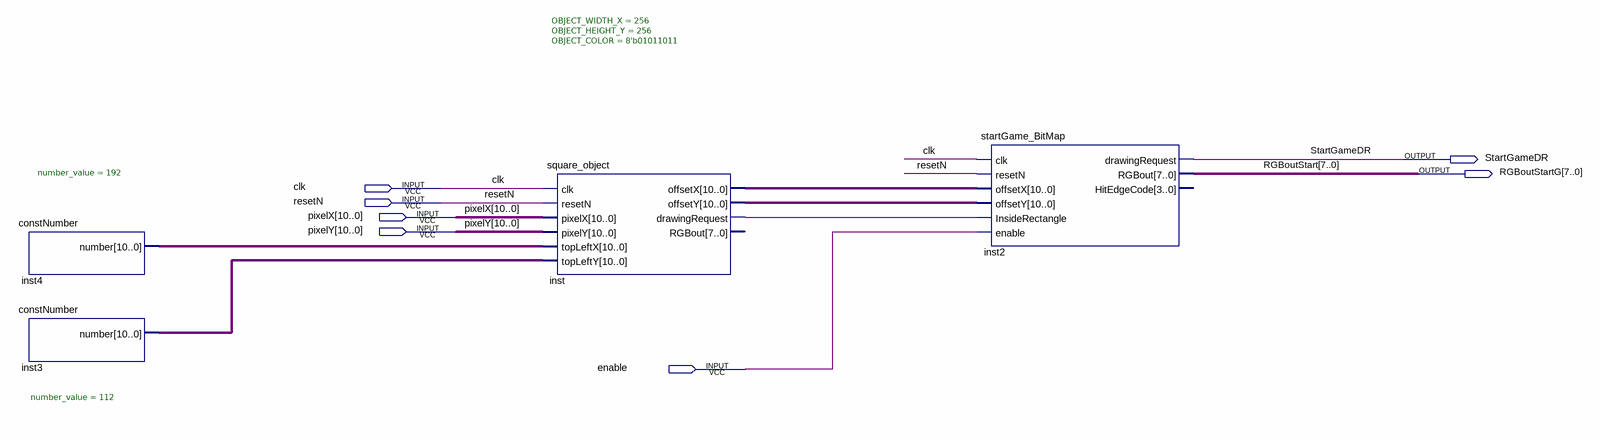
[diagram p0: schematic sheet]
// Quartus schematic startGameBlock.bdf as structural Verilog: 4 symbols, 7 pins
module startGameBlock (
  input  clk,
  input  resetN,
  input  [10:0] pixelX,
  input  [10:0] pixelY,
  input  enable,
  output StartGameDR,
  output [7:0] RGBoutStartG
);

  wire inst_drawingrequest;
  wire [10:0] inst3_number, inst4_number, inst_offsetx, inst_offsety;

  constNumber #(.number_value(192)) inst4 (.number(inst4_number));
  constNumber #(.number_value(112)) inst3 (.number(inst3_number));
  square_object #(.OBJECT_WIDTH_X(256), .OBJECT_HEIGHT_Y(256), .OBJECT_COLOR(8'b01011011)) inst (
    .clk(clk), .resetN(resetN), .pixelX(pixelX), .pixelY(pixelY), .topLeftX(inst4_number),
    .topLeftY(inst3_number), .offsetX(inst_offsetx), .offsetY(inst_offsety),
    .drawingRequest(inst_drawingrequest));  // open: RGBout
  startGame_BitMap inst2 (
    .clk(clk), .resetN(resetN), .offsetX(inst_offsetx), .offsetY(inst_offsety),
    .InsideRectangle(inst_drawingrequest), .enable(enable), .drawingRequest(StartGameDR),
    .RGBout(RGBoutStartG));  // open: HitEdgeCode

  // Other names for the same wires on the sheet: RGBoutStart[7:0] = RGBoutStartG
endmodule
